# Altium schematic sheet 电子脚铐手持式主控板_MCU.SchDoc
size A4
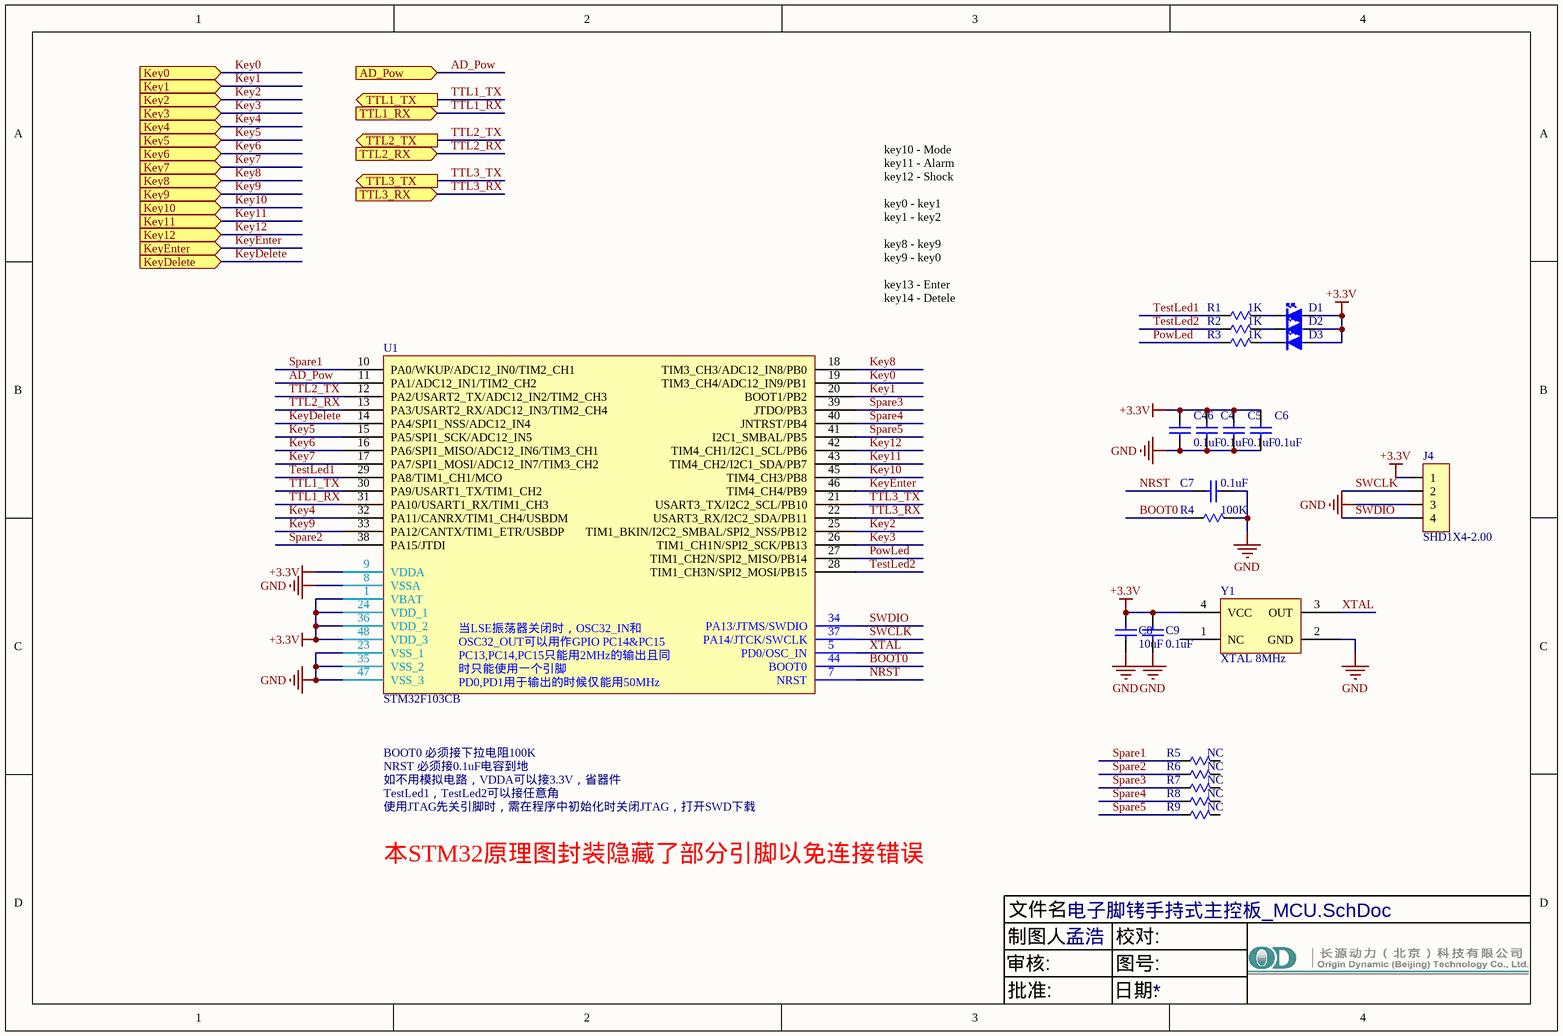
[diagram p0: 电子脚铐手持式主控板_MCU.SchDoc]

## Parts
C4  0.1uF  [C0603]
C5  0.1uF  [C0603]
C6  0.1uF  [C0603]
C7  0.1uF  [C0603]
C8  10uF  [C0603]
C9  0.1uF  [C0603]
C46  0.1uF  [C0603]
D1  LED  [LED0805]  (value not drawn)
D2  LED  [LED0805]  (value not drawn)
D3  LED  [LED0805]  (value not drawn)
J4  SHD1X4-2.00  [Jk1*4-2.0]
R1  1K  [R0603]
R2  1K  [R0603]
R3  1K  [R0603]
R4  100K  [R0603]
R5  NC  [R0603]
R6  NC  [R0603]
R7  NC  [R0603]
R8  NC  [R0603]
R9  NC  [R0603]
U1  STM32F103CB  [LQFP48]
Y1  XTAL 8MHz  [XTAL5032]

## Ports
AD_Pow (in), Key0 (in), Key1 (in), Key2 (in), Key3 (in), Key4 (in), Key5 (in), Key6 (in), Key7 (in), Key8 (in), Key9 (in), Key10 (in), Key11 (in), Key12 (in), KeyDelete (in), KeyEnter (in), TTL1_RX (in), TTL1_TX (out), TTL2_RX (in), TTL2_TX (out), TTL3_RX (in), TTL3_TX (out)

## Nets
+3.3V: C4.1 C5.1 C6.1 C8.2 C9.2 C46.1 D1.1(A) D2.1(A) D3.1(A) J4.1 U1.1(VBAT) U1.9(VDDA) U1.24(VDD_1) U1.36(VDD_2) U1.48(VDD_3) Y1.4(VCC)
GND: C4.2 C5.2 C6.2 C7.2 C8.1 C9.1 C46.2 J4.3 R4.2 U1.8(VSSA) U1.23(VSS_1) U1.35(VSS_2) U1.47(VSS_3) Y1.2(GND)
AD_Pow: U1.11(PA1/ADC12_IN1/TIM2_CH2) ; port AD_Pow
BOOT0: R4.1 U1.44(BOOT0)
Key0: U1.19(TIM3_CH4/ADC12_IN9/PB1) ; port Key0
Key1: U1.20(BOOT1/PB2) ; port Key1
Key2: U1.25(TIM1_BKIN/I2C2_SMBAL/SPI2_NSS/PB12) ; port Key2
Key3: U1.26(TIM1_CH1N/SPI2_SCK/PB13) ; port Key3
Key4: U1.32(PA11/CANRX/TIM1_CH4/USBDM) ; port Key4
Key5: U1.15(PA5/SPI1_SCK/ADC12_IN5) ; port Key5
Key6: U1.16(PA6/SPI1_MISO/ADC12_IN6/TIM3_CH1) ; port Key6
Key7: U1.17(PA7/SPI1_MOSI/ADC12_IN7/TIM3_CH2) ; port Key7
Key8: U1.18(TIM3_CH3/ADC12_IN8/PB0) ; port Key8
Key9: U1.33(PA12/CANTX/TIM1_ETR/USBDP) ; port Key9
Key10: U1.45(TIM4_CH3/PB8) ; port Key10
Key11: U1.43(TIM4_CH2/I2C1_SDA/PB7) ; port Key11
Key12: U1.42(TIM4_CH1/I2C1_SCL/PB6) ; port Key12
KeyDelete: U1.14(PA4/SPI1_NSS/ADC12_IN4) ; port KeyDelete
KeyEnter: U1.46(TIM4_CH4/PB9) ; port KeyEnter
NRST: C7.1 U1.7(NRST)
PowLed: R3.1 U1.27(TIM1_CH2N/SPI2_MISO/PB14)
Spare1: R5.1 U1.10(PA0/WKUP/ADC12_IN0/TIM2_CH1)
Spare2: R6.1 U1.38(PA15/JTDI)
Spare3: R7.1 U1.39(JTDO/PB3)
Spare4: R8.1 U1.40(JNTRST/PB4)
Spare5: R9.1 U1.41(I2C1_SMBAL/PB5)
SWCLK: J4.2 U1.37(PA14/JTCK/SWCLK)
SWDIO: J4.4 U1.34(PA13/JTMS/SWDIO)
TestLed1: R1.1 U1.29(PA8/TIM1_CH1/MCO)
TestLed2: R2.1 U1.28(TIM1_CH3N/SPI2_MOSI/PB15)
TTL1_RX: U1.31(PA10/USART1_RX/TIM1_CH3) ; port TTL1_RX
TTL1_TX: U1.30(PA9/USART1_TX/TIM1_CH2) ; port TTL1_TX
TTL2_RX: U1.13(PA3/USART2_RX/ADC12_IN3/TIM2_CH4) ; port TTL2_RX
TTL2_TX: U1.12(PA2/USART2_TX/ADC12_IN2/TIM2_CH3) ; port TTL2_TX
TTL3_RX: U1.22(USART3_RX/I2C2_SDA/PB11) ; port TTL3_RX
TTL3_TX: U1.21(USART3_TX/I2C2_SCL/PB10) ; port TTL3_TX
XTAL: U1.5(PD0/OSC_IN) Y1.3(OUT)
NetD1_2: D1.2(K) R1.2
NetD2_2: D2.2(K) R2.2
NetD3_2: D3.2(K) R3.2

Not connected (* = marked no-connect by the designer): R5 2; R6 2; R7 2; R8 2; R9 2; U1 2(PC13-TAMPER-RTC) 3(PC14-OSC32_IN) 4(PC15-OSC32_OUT) 6(PD1/OSC_OUT); Y1 1(NC)

## Notes on the sheet
- key10 - Mode
  key11 - Alarm
  key12 - Shock
  key0 - key1
  key1 - key2
  key8 - key9
  key9 - key0
  key13 - Enter
  key14 - Detele
- BOOT0 必须接下拉电阻100K
- NRST 必须接0.1uF电容到地
- 如不用模拟电路，VDDA可以接3.3V，省器件
- TestLed1，TestLed2可以接任意角
- 使用JTAG先关引脚时，需在程序中初始化时关闭JTAG，打开SWD下载
- 本STM32原理图封装隐藏了部分引脚以免连接错误
- 文件名:
- 审核:
- 制图人:
- 孟浩
- 校对:
- 图号:
- 批准:
- 日期:
- (in symbol STM32F103Cx) OSC32_IN和OSC32_OUT可以用作通用IO PC14和PC15; PC13,PC14,PC15只能用于2MHz的输出模式且同时只能使用一个引脚; 当LSE振荡器关闭时，OSC32_IN和OSC32_OUT可以用作GPIO PC14&PC15 / PC13,PC14,PC15只能用2MHz的输出且同时只能使用一个引脚 / PD0,PD1用于输出的时候仅能用50MHz

## Library data of the parts
C4-C9 C46 = CAP: Published: 8-Jun-2000; LatestRevisionDate: 17-Jul-2002; LatestRevisionNote: Re-released for DXP Platform.; PackageReference: RAD-0.3; Publisher: Altium Limited
J4 = HEADER1X4
R1-R9 = RES: Resistor; Published: 8-Jun-2000; LatestRevisionDate: 17-Jul-2002; LatestRevisionNote: Re-released for DXP Platform.; PackageReference: AXIAL-0.3; Publisher: Altium Limited
U1 = STM32F103Cx
Y1 = XTAL